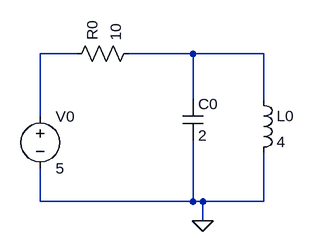
[diagram p0: schematic test.asc]
test.asc, the LTspice schematic file:
Version 4
SHEET 1 880 680
WIRE 196 172 140 172
WIRE 375 172 276 172
WIRE 484 172 375 172
WIRE 375 242 375 172
WIRE 484 244 484 172
WIRE 140 269 140 172
WIRE 140 400 140 349
WIRE 375 400 375 306
WIRE 375 400 140 400
WIRE 390 400 375 400
WIRE 484 400 484 324
WIRE 484 400 390 400
WIRE 390 430 390 400
FLAG 390 430 0
SYMBOL cap 359 242 R0
SYMATTR InstName C0
SYMATTR Value 2
SYMBOL voltage 140 253 R0
SYMATTR InstName V0
SYMATTR Value 5
SYMBOL ind 468 228 R0
SYMATTR InstName L0
SYMATTR Value 4
SYMBOL res 180 188 R270
SYMATTR InstName R0
SYMATTR Value 10

The netlist it stands for:
* test.asc
C0 N002 0 2
V0 N001 0 5
L0 N002 0 4
R0 N001 N002 10
.backanno
.end